# Altium project DashBoard.PrjPCB
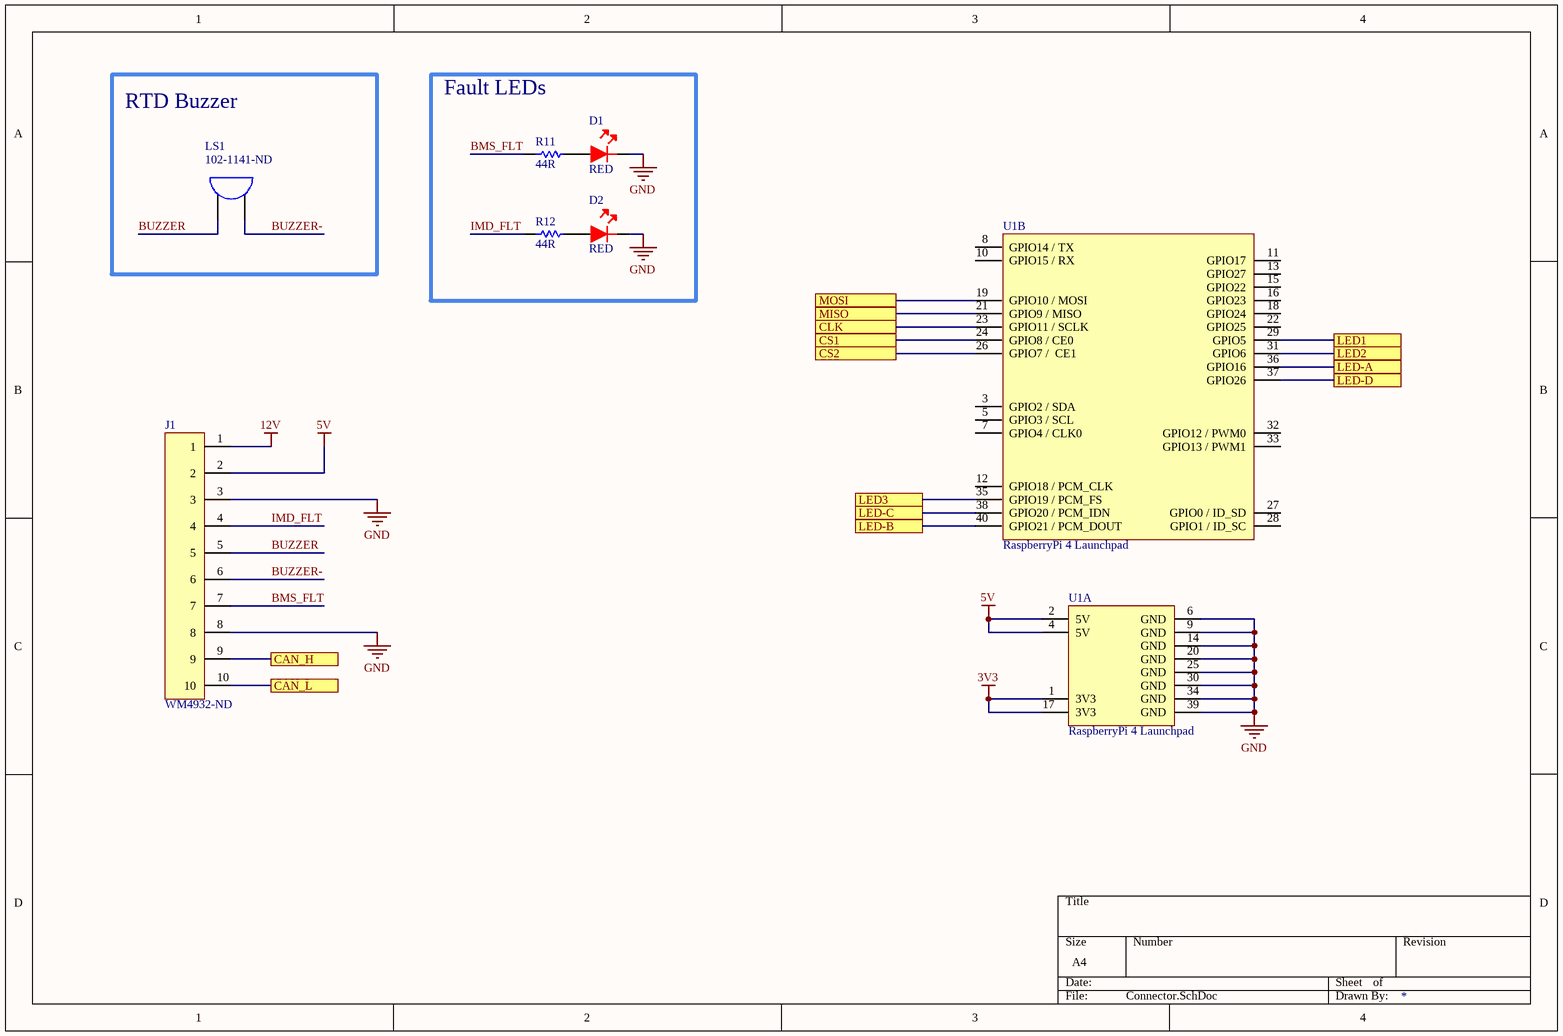
[diagram p0: Connector.SchDoc]
4 sheets, 50 parts. Net scope: flat (ports and power ports of the same name join across sheets).
Board file: DashBoard.PcbDoc
Sheets:
  Connector.SchDoc
  SpeedLEDs.SchDoc
  VoltageLEDs.SchDoc
  SPI.SchDoc

## Sheet Connector.SchDoc
size A4; Organization: Altium Limited; Address1: L3, 12a Rodborough Rd; Address2: Frenchs Forest; Address3: NSW; Address4: Australia 2086

### Parts
D1  RED  [LED]
D2  RED  [LED]
J1  WM4932-ND  [10PIN]
LS1  102-1141-ND  [Buzzer]
R11  44R  [RES-0603]
R12  44R  [RES-0603]
U1  RaspberryPi 4 Launchpad  [Rpi Connector]  (parts A,B of 2)

### Blocks framed on the sheet
RTD Buzzer: LS1
Fault LEDs: D1 D2 R11 R12

### Ports
CAN_H, CAN_L, CLK, CS1, CS2, LED1, LED2, LED3, LED-A, LED-B, LED-C, LED-D, MISO, MOSI

### Nets
3V3: U1.1(3V3) U1.17(3V3)
5V: J1.2 U1.2(5V) U1.4(5V)
12V: J1.1
GND: D1.2 D2.2 J1.3 J1.8 U1.6(GND) U1.9(GND) U1.14(GND) U1.20(GND) U1.25(GND) U1.30(GND) U1.34(GND) U1.39(GND)
A: U1.36(GPIO16) ; port LED-A
B: U1.40(GPIO21_/_PCM_DOUT) ; port LED-B
BMS_FLT: J1.7 R11.1
BUZZER: J1.5 LS1.1
BUZZER-: J1.6 LS1.2
C: U1.38(GPIO20_/_PCM_IDN) ; port LED-C
CAN_N: J1.10 ; port CAN_L
CAN_P: J1.9 ; port CAN_H
CS_1: U1.24(GPIO8_/_CE0) ; port CS1
CS_2: U1.26(GPIO7_/__CE1) ; port CS2
D: U1.37(GPIO26) ; port LED-D
IMD_FLT: J1.4 R12.1
LED-1: U1.29(GPIO5) ; port LED1
LED-2: U1.31(GPIO6) ; port LED2
LED-3: U1.35(GPIO19_/_PCM_FS) ; port LED3
SCK: U1.23(GPIO11_/_SCLK) ; port CLK
SDI: U1.19(GPIO10_/_MOSI) ; port MOSI
SDO: U1.21(GPIO9_/_MISO) ; port MISO
NetD1_1: D1.1 R11.2
NetD2_1: D2.1 R12.2

Not connected (* = marked no-connect by the designer): U1 3(GPIO2_/_SDA) 5(GPIO3_/_SCL) 7(GPIO4_/_CLK0) 8(GPIO14_/_TX) 10(GPIO15_/_RX) 11(GPIO17) 12(GPIO18_/_PCM_CLK) 13(GPIO27) 15(GPIO22) 16(GPIO23) 18(GPIO24) 22(GPIO25) 27(GPIO0_/_ID_SD) 28(GPIO1_/_ID_SC) 32(GPIO12_/_PWM0) 33(GPIO13_/_PWM1)

### Notes on the sheet
- Title
- Size:
- Date:
- A4
- Number:
- Time:
- Revision:
- Sheet
- of
- File:

### Library data of the parts
D1 D2 = RED_LED: 2835 PLCC2 RED WLD: 620NM TYP. 1; Manufacturer: QT-Brightek; Manufacturer Part Number: QBHP686-RH; Lens Color: Colorless; Lens Style: Flat; Lens Transparency: Clear; Forward Voltage: 2.4V; Test Current: 150mA; Viewing Angle: 120°; Supplier 1: Digi-Key; Stock 1: 3207; Pricing 1: 1=0.85, 10=0.553, 100=0.3625, 1000=0.2862 (USD); Mount: Surface Mount; Case/Package: 1113; Color: Red; Case Code (Imperial): 1113; Packaging: Tape and Reel; Dominant Wavelength: 620nm; Length: 3.1mm; Width: 2.8mm; Height: 1mm; ComponentLink1URL: http://www.qt-brightek.com/datasheet/QBHP686-XXH Series.pdf?src-supplier=Digi-Key; ComponentLink1Description: http://www.qt-brightek.com/datasheet/QBHP686-XXH Series.pdf?src-supplier=Digi-Key; Supplier Part Number 1: 1516-1369-6-ND
J1 = 10PIN: CONN HEADER R/A 10POS 2.54MM; Manufacturer: Molex; Manufacturer Part Number: 0705530044; Number of Positions: 10; Gender: Male; Contact Resistance: 30mR; Connector Type: Male Pin; Supplier 1: Digi-Key; Stock 1: 1173; Pricing 1: 1=2.61, 10=2.367, 100=2.0288, 500=1.69068, 1000=1.44915, 5000=1.28491 (USD); Mount: Through Hole; Housing Material: Polyester; Housing Color: Black; Contact Plating: Tin; Contact Material: Bronze; Color: Black; Min Operating Temperature: -40°C; Max Operating Temperature: 105°C; Number of Rows: 1; Packaging: Rail/Tube; Termination: Solder; Orientation: Right Angle; Number of Contacts: 10; Length: 27.95mm; Pitch: 2.54mm; Depth: 13.59mm; Contact Mating Length: 0.24inch; ComponentLink1URL: http://www.molex.com/webdocs/datasheets/pdf/en-us/0705530044_PCB_HEADERS.pdf?src-supplier=Avnet; ComponentLink1Description: http://www.molex.com/webdocs/datasheets/pdf/en-us/0705530044_PCB_HEADERS.pdf?src-supplier=Avnet; Supplier Part Number 1: WM4932-ND
LS1 = Buzzer: AUDIO PIEZO TRANSDUCER 30V TH; Manufacturer: CUI; Voltage Rating: 10V; Operating Supply Current: 8mA; Self Resonant Frequency: 2kHz; Capacitance: 28nF; Washable: No; Supplier 1: Digi-Key; Manufacturer Part Number: CEP-1116; Stock 1: 11267; Pricing 1: 1=1.91, 10=1.588, 25=1.468, 50=1.3806, 100=1.2963, 500=1.11268, 1000=1.0621 (USD); Mount: Through Hole; Case/Package: Radial; Min Operating Temperature: -30°C; Max Operating Temperature: 85°C; Packaging: Bulk; Termination: PC Pins; Diameter: 30mm; Height: 10.5mm; Lead Free: Lead Free; Supplier Part Number 1: 102-1141-ND
R11 R12 = 0603-44R: Manufacturer: Panasonic; Manufacturer Part Number: ERJ-3EKF44R2V; Resistance: 44.2R; Tolerance: 1%; Power Rating: 100mW; Voltage Rating: 75V; Temperature Coefficient: 100ppm/°C; Voltage Rating (DC): 50V; Supplier 1: Digi-Key; Stock 1: 31052; Pricing 1: 1=0.1, 10=0.037, 100=0.0149, 1000=0.0067, 2500=0.00582 (USD); Mount: Surface Mount; Case/Package: 0603; Case Code (Imperial): 0603; Case Code (Metric): 1608; Weight: 7.1E-05oz; Contact Plating: Tin; Min Operating Temperature: -55°C; Max Operating Temperature: 155°C; Packaging: Tape and Reel; Package Quantity: 1; Resistor Type: Thick Film; Termination: SMD/SMT; Number of Terminations: 2; Max Power Dissipation: 100mW; Features: Automotive AEC-Q200; Series: ERJ; Resistance Tolerance: 1%; Construction: Rectangular; Length: 1.6mm; Width: 0.8mm; Height: 0.022inch; Depth: 0.8mm; REACH SVHC: No SVHC; Military Standard: Not; RoHS Compliant: Yes; ComponentLink1URL: http://industrial.panasonic.com/www-data/pdf/AOA0000/AOA0000CE2.pdf?src-supplier=Avnet; ComponentLink1Description: http://industrial.panasonic.com/www-data/pdf/AOA0000/AOA0000CE2.pdf?src-supplier=Avnet; ComponentLink2URL: http://industrial.panasonic.com/cdbs/www-data/pdf/RDA0000/AOA0000C304.pdf?src-supplier=Farnell; ComponentLink2Description: http://industrial.panasonic.com/cdbs/www-data/pdf/RDA0000/AOA0000C304.pdf?src-supplier=Farnell; ComponentLink3URL: http://www.farnell.com/datasheets/426256.pdf?src-supplier=Element14; ComponentLink3Description: http://www.farnell.com/datasheets/426256.pdf?src-supplier=Element14; Supplier Part Number 1: P44.2HDKR-ND
U1 = RasPi4: CONNECTOR DEV BOARD RaspberryPi 4; Manufacturer: Sullins; Manufacturer Part Number: PPPC202LFBN-RC; Number of Positions: 40; Connector Type: Header; Pitch: 0.1inch; Supplier 1: Digi-Key; Stock 1: 10499; Pricing 1: 1=2.38, 10=2.068, 80=1.84838, 440=1.54034, 1000=1.3203, 5000=1.1736 (USD); Mount: Through Hole; Color: Black; Contact Plating: Gold; Contact Material: Bronze; Housing Material: Plastic; Package Quantity: 1000; Number of Rows: 2; Packaging: Bulk; Termination: Solder; Contact Type: Female Socket; Length: 51.3mm; Width: 5mm; Height: 8.5mm; Row Spacing: 0.1inch; Lead Free: Lead Free; RoHS Compliant: Yes; Supplier Part Number 1: S7123-ND

## Sheet SpeedLEDs.SchDoc
size A4; Organization: Altium Limited; Address1: L3, 12a Rodborough Rd; Address2: Frenchs Forest; Address3: NSW; Address4: Australia 2086
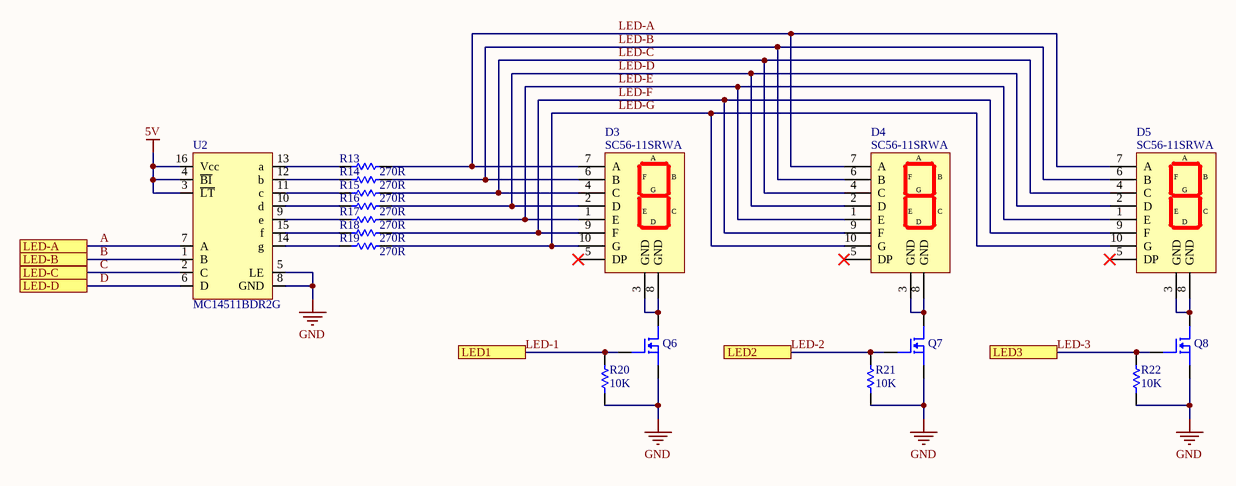
[diagram p1: SpeedLEDs.SchDoc]

### Parts
D3  SC56-11SRWA  [7-seg]
D4  SC56-11SRWA  [7-seg]
D5  SC56-11SRWA  [7-seg]
Q6  DMN6140L-13DICT-ND  [SOT-23-3]  (value not drawn)
Q7  DMN6140L-13DICT-ND  [SOT-23-3]  (value not drawn)
Q8  DMN6140L-13DICT-ND  [SOT-23-3]  (value not drawn)
R13  270R  [RES-0603]
R14  270R  [RES-0603]
R15  270R  [RES-0603]
R16  270R  [RES-0603]
R17  270R  [RES-0603]
R18  270R  [RES-0603]
R19  270R  [RES-0603]
R20  10K  [RES-0603]
R21  10K  [RES-0603]
R22  10K  [RES-0603]
U2  MC14511BDR2G  [SOIC16]

### Ports
LED1, LED2, LED3, LED-A, LED-B, LED-C, LED-D

### Nets
5V: U2.3(~{LT}) U2.4(~{BI}) U2.16(Vcc)
GND: Q6.3 Q7.3 Q8.3 R20.1 R21.1 R22.1 U2.5(LE) U2.8(GND)
A: U2.7(A) ; port LED-A
B: U2.1(B) ; port LED-B
C: U2.2(C) ; port LED-C
D: U2.6(D) ; port LED-D
LED-1: Q6.1 R20.2 ; port LED1
LED-2: Q7.1 R21.2 ; port LED2
LED-3: Q8.1 R22.2 ; port LED3
LED-A: D3.7(A) D4.7(A) D5.7(A) R13.2
LED-B: D3.6(B) D4.6(B) D5.6(B) R14.2
LED-C: D3.4(C) D4.4(C) D5.4(C) R15.2
LED-D: D3.2(D) D4.2(D) D5.2(D) R16.2
LED-E: D3.1(E) D4.1(E) D5.1(E) R17.2
LED-F: D3.9(F) D4.9(F) D5.9(F) R18.2
LED-G: D3.10(G) D4.10(G) D5.10(G) R19.2
NetD3_3: D3.3(GND) D3.8(GND) Q6.2
NetD4_3: D4.3(GND) D4.8(GND) Q7.2
NetD5_3: D5.3(GND) D5.8(GND) Q8.2
NetR13_1: R13.1 U2.13(a)
NetR14_1: R14.1 U2.12(b)
NetR15_1: R15.1 U2.11(c)
NetR16_1: R16.1 U2.10(d)
NetR17_1: R17.1 U2.9(e)
NetR18_1: R18.1 U2.15(f)
NetR19_1: R19.1 U2.14(g)

Not connected (* = marked no-connect by the designer): D3 5(DP)*; D4 5(DP)*; D5 5(DP)*

### Notes on the sheet
- Title
- Size:
- Date:
- A4
- Number:
- Time:
- Revision:
- Sheet
- of
- File:

### Library data of the parts
D3-D5 = 7-segment: DISPLAY 7SEG 0.56" SGL RED 10DIP; Manufacturer: Kingbright; Wavelength: 640nm; Luminous Intensity: 34mcd; Forward Voltage: 1.85V; Element Configuration: Common Cathode; Forward Current: 20mA; Number of Characters: 1; Max Power Dissipation: 75mW; Supplier 1: Digi-Key; Manufacturer Part Number: SC56-11SRWA; Stock 1: 32391; Pricing 1: 1=1.96, 10=1.24, 100=0.9177, 500=0.84334, 1000=0.702 (USD); Case/Package: DIP; Color: Red; Min Operating Temperature: -40°C; Max Operating Temperature: 85°C; Package Quantity: 40; Illumination Color: Red; Operating Supply Voltage: 1.85V; Packaging: Bulk; Test Current: 20mA; Display Type: Segment; Power Consumption: 75mW; Width: 0.5inch; Height: 0.75inch; RoHS Compliant: Yes; Lead Free: Lead Free; REACH SVHC: No SVHC; ComponentLink1URL: http://www.farnell.com/datasheets/2047590.pdf?src-supplier=Element14; ComponentLink1Description: http://www.farnell.com/datasheets/2047590.pdf?src-supplier=Element14; ComponentLink2URL: http://www.mouser.com/ds/2/216/SC56-11SRWA-66719.pdf?src-supplier=Mouser; ComponentLink2Description: http://www.mouser.com/ds/2/216/SC56-11SRWA-66719.pdf?src-supplier=Mouser; ComponentLink3URL: http://www.kingbrightusa.com/images/catalog/SPEC/SC56-11SRWA.pdf?src-supplier=Future+Electronics; ComponentLink3Description: http://www.kingbrightusa.com/images/catalog/SPEC/SC56-11SRWA.pdf?src-supplier=Future+Electronics; Supplier Part Number 1: 754-1467-5-ND
Q6-Q8 = N-FET-60V-1.6A: MOSFET N-CH 60V 1.6A SOT23; Manufacturer: Diodes; Rds On Max: 140mR; Input Capacitance: 315pF; Max Power Dissipation: 700mW; Supplier 1: Digi-Key; Manufacturer Part Number: DMN6140L-13; Stock 1: 274948; Pricing 1: 1=0.34, 10=0.256, 25=0.224, 100=0.1217, 250=0.12104, 500=0.09926, 1000=0.07365, 2500=0.06468, 5000=0.05924 (USD); Mount: Surface Mount; Case/Package: TO-236-3; Min Operating Temperature: -55°C; Max Operating Temperature: 150°C; Package Quantity: 10000; Packaging: Cut Tape; Drain to Source Voltage (Vdss): 60V; Continuous Drain Current (ID): 1.6A; ComponentLink1URL: https://www.diodes.com/assets/Datasheets/DMN6140L.pdf?src-supplier=Digi-Key; ComponentLink1Description: https://www.diodes.com/assets/Datasheets/DMN6140L.pdf?src-supplier=Digi-Key; Supplier Part Number 1: DMN6140L-13DIDKR-ND
R13-R19 = 0603-270R: RES SMD 270 OHM 0.5% 1/10W 0603; Manufacturer: Yageo; Manufacturer Part Number: RT0603DRE07270RL; Voltage Rating: 75V; Power Rating: 100mW; Temperature Coefficient: 50ppm/°C; Voltage Rating (DC): 50V; Supplier 1: Digi-Key; Stock 1: 5811; Pricing 1: 1=0.1, 10=0.092, 100=0.0352, 1000=0.01549, 2500=0.01338 (USD); Case/Package: 0603; Case Code (Metric): 1608; Case Code (Imperial): 0603; Min Operating Temperature: -55°C; Max Operating Temperature: 155°C; Resistance: 270R; Tolerance: 0.5%; Packaging: Tape and Reel; Package Quantity: 5000; Termination: SMD/SMT; Resistor Type: Thin Film; Number of Terminations: 2; Max Power Dissipation: 100mW; Features: Moisture Resistant; Series: RT; Length: 0.063inch; Width: 0.031inch; Height: 0.022inch; Lead Free: Lead Free; RoHS Compliant: Yes; ComponentLink1URL: http://www.yageo.com/NewPortal/yageodocoutput?fileName=/pdf/R-Chip/PYu-RT_1-to-0.05_RoHS_L_5.pdf&src-supplier=Digi-Key; ComponentLink1Description: http://www.yageo.com/NewPortal/yageodocoutput?fileName=/pdf/R-Chip/PYu-RT_1-to-0.05_RoHS_L_5.pdf&src-supplier=Digi-Key; Supplier Part Number 1: 311-2504-1-ND
R20-R22 = 0603-10KR: RES SMD 10K OHM 5% 1/10W 0603; Manufacturer: Yageo; Manufacturer Part Number: RC0603JR-0710KL; Resistance: 10kR; Voltage Rating (DC): 50V; Temperature Coefficient: 100ppm/°C; Power Rating: 100mW; Supplier 1: Digi-Key; Stock 1: 3006558; Pricing 1: 1=0.1, 10=0.019, 100=0.0077, 1000=0.00347, 2500=0.00301 (USD); Case/Package: 0603; Number of Pins: 2; Contact Plating: Tin,Matte; Case Code (Imperial): 0603; Case Code (Metric): 1608; Min Operating Temperature: -55°C; Max Operating Temperature: 155°C; Packaging: Tape and Reel; Tolerance: 5%; Composition: Thick Film; Voltage Rating: 50V; Termination: SMD/SMT; Military Standard: Not; Features: Moisture Resistant; Max Power Dissipation: 100mW; Number of Terminations: 2; Length: 0.063inch; Width: 0.031inch; Depth: 0.8mm; Height - Seated (Max): 0.022inch; Radiation Hardening: No; REACH SVHC: Unknown; Lead Free: Lead Free; ComponentLink1URL: http://www.yageo.com/documents/recent/PYu-RC_Group_51_RoHS_L_10.pdf?src-supplier=Digi-Key; ComponentLink1Description: http://www.yageo.com/documents/recent/PYu-RC_Group_51_RoHS_L_10.pdf?src-supplier=Digi-Key; Supplier Part Number 1: 311-10KGRDKR-ND
U2 = MC14511BDR2G: IC DRVR 7 SEGMENT 16SOIC; Manufacturer: ON Semiconductor; Number of Elements: 1; Propagation Delay: 1440ns; Max Supply Voltage: 18V; Min Supply Voltage: 3V; Number of Inputs: 4; Number of Outputs: 7; Operating Supply Current: 10uA; Logic Function: Decoder,Latch; Polarity: Non-Inverting; High Level Output Current: -25mA; Low Level Output Current: 4.2mA; Quiescent Current: 20uA; Display Type: LCD; Supplier 1: Digi-Key; Manufacturer Part Number: MC14511BDR2G; Stock 1: 82; Pricing 1: 1=0.63, 10=0.555, 25=0.5216, 100=0.4256, 250=0.39532, 500=0.33644, 1000=0.27772 (USD); Mount: Surface Mount; Case/Package: SOIC; Number of Pins: 16; Min Operating Temperature: -55°C; Max Operating Temperature: 125°C; Packaging: Tape and Reel; Package Quantity: 2500; Number of Bits: 4; Number of Input Lines: 4; Number of Output Lines: 7; Turn-On Delay Time: 1440ns; Series: -; Technology: CMOS; Radiation Hardening: No; Lead Free: Lead Free; Halogen Free: Halogen Free; RoHS Compliant: Yes; ComponentLink1URL: https://www.verical.com/server-webapp/html/getDatasheet?partID=319336&src-supplier=Verical; ComponentLink1Description: https://www.verical.com/server-webapp/html/getDatasheet?partID=319336&src-supplier=Verical; ComponentLink2URL: http://www.onsemi.com/pub_link/Collateral/MC14511B-D.PDF?src-supplier=Digi-Key; ComponentLink2Description: http://www.onsemi.com/pub_link/Collateral/MC14511B-D.PDF?src-supplier=Digi-Key; Supplier Part Number 1: MC14511BDR2GOSDKR-ND

## Sheet VoltageLEDs.SchDoc
size A4; Organization: Altium Limited; Address1: L3, 12a Rodborough Rd; Address2: Frenchs Forest; Address3: NSW; Address4: Australia 2086
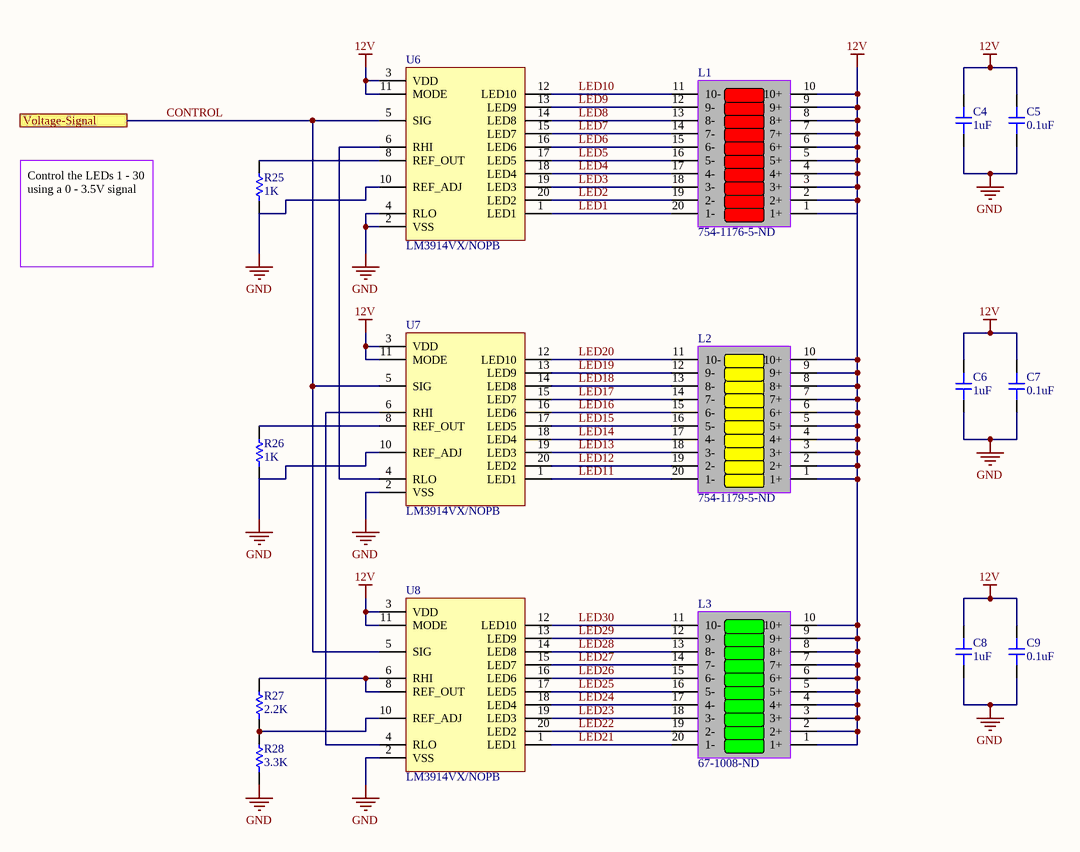
[diagram p2: VoltageLEDs.SchDoc]

### Parts
C4  1uF  [CAP-0805]
C5  0.1uF  [CAP-0805]
C6  1uF  [CAP-0805]
C7  0.1uF  [CAP-0805]
C8  1uF  [CAP-0805]
C9  0.1uF  [CAP-0805]
L1  754-1176-5-ND  [LEDBAR-10]
L2  754-1179-5-ND  [LEDBAR-10]
L3  67-1008-ND  [LEDBAR-10]
R25  1K  [RES-0603]
R26  1K  [RES-0603]
R27  2.2K  [RES-0603]
R28  3.3K  [RES-0603]
U6  LM3914VX/NOPB  [PLCC127P990X990X457-20N]
U7  LM3914VX/NOPB  [PLCC127P990X990X457-20N]
U8  LM3914VX/NOPB  [PLCC127P990X990X457-20N]

### Ports
Voltage-Signal

### Nets
12V: C4.2 C5.2 C6.2 C7.2 C8.2 C9.2 L1.1(1+) L1.2(2+) L1.3(3+) L1.4(4+) L1.5(5+) L1.6(6+) L1.7(7+) L1.8(8+) L1.9(9+) L1.10(10+) L2.1(1+) L2.2(2+) L2.3(3+) L2.4(4+) L2.5(5+) L2.6(6+) L2.7(7+) L2.8(8+) L2.9(9+) L2.10(10+) L3.1(1+) L3.2(2+) L3.3(3+) L3.4(4+) L3.5(5+) L3.6(6+) L3.7(7+) L3.8(8+) L3.9(9+) L3.10(10+) U6.3(VDD) U6.11(MODE) U7.3(VDD) U7.11(MODE) U8.3(VDD) U8.11(MODE)
GND: C4.1 C5.1 C6.1 C7.1 C8.1 C9.1 R25.1 R26.1 R28.1 U6.2(VSS) U6.4(RLO) U6.10(REF_ADJ) U7.2(VSS) U7.10(REF_ADJ) U8.2(VSS)
CONTROL: U6.5(SIG) U7.5(SIG) U8.5(SIG) ; port Voltage-Signal
LED1: L1.20(1-) U6.1(LED1)
LED2: L1.19(2-) U6.20(LED2)
LED3: L1.18(3-) U6.19(LED3)
LED4: L1.17(4-) U6.18(LED4)
LED5: L1.16(5-) U6.17(LED5)
LED6: L1.15(6-) U6.16(LED6)
LED7: L1.14(7-) U6.15(LED7)
LED8: L1.13(8-) U6.14(LED8)
LED9: L1.12(9-) U6.13(LED9)
LED10: L1.11(10-) U6.12(LED10)
LED11: L2.20(1-) U7.1(LED1)
LED12: L2.19(2-) U7.20(LED2)
LED13: L2.18(3-) U7.19(LED3)
LED14: L2.17(4-) U7.18(LED4)
LED15: L2.16(5-) U7.17(LED5)
LED16: L2.15(6-) U7.16(LED6)
LED17: L2.14(7-) U7.15(LED7)
LED18: L2.13(8-) U7.14(LED8)
LED19: L2.12(9-) U7.13(LED9)
LED20: L2.11(10-) U7.12(LED10)
LED21: L3.20(1-) U8.1(LED1)
LED22: L3.19(2-) U8.20(LED2)
LED23: L3.18(3-) U8.19(LED3)
LED24: L3.17(4-) U8.18(LED4)
LED25: L3.16(5-) U8.17(LED5)
LED26: L3.15(6-) U8.16(LED6)
LED27: L3.14(7-) U8.15(LED7)
LED28: L3.13(8-) U8.14(LED8)
LED29: L3.12(9-) U8.13(LED9)
LED30: L3.11(10-) U8.12(LED10)
NetR25_2: R25.2 U6.8(REF_OUT)
NetR26_2: R26.2 U7.8(REF_OUT)
NetR27_1: R27.1 R28.2 U8.10(REF_ADJ)
NetR27_2: R27.2 U8.6(RHI) U8.8(REF_OUT)
NetU6_6: U6.6(RHI) U7.4(RLO)
NetU7_6: U7.6(RHI) U8.4(RLO)

### Notes on the sheet
- Control the LEDs 1 - 30 using a 0 - 3.5V signal
- Title
- Size:
- Date:
- A4
- Number:
- Time:
- Revision:
- Sheet
- of
- File:

### Library data of the parts
C4 C6 C8 = C0805C105K5PACTU: CAP CER 1UF 50V X5R 0805; Manufacturer: KEMET; Dielectric Material: Ceramic; Tolerance: 10%; Supplier 1: Digi-Key; Manufacturer Part Number: C0805C105K5PACTU; Stock 1: 7193; Pricing 1: 1=0.33, 10=0.23, 100=0.1378, 500=0.10334, 1000=0.08726 (USD); Mount: Surface Mount; Case/Package: 0805; Weight: 0.000194oz; Case Code (Metric): 2012; Case Code (Imperial): 0805; Min Operating Temperature: -55°C; Max Operating Temperature: 85°C; Voltage Rating: 50V; Dielectric: X5R; Packaging: Tape and Reel; Termination: SMD/SMT; Voltage Rating (DC): 50V; Package Quantity: 2500; Capacitance: 1uF; Length: 0.079inch; Width: 0.049inch; Thickness: 0.055inch; REACH SVHC: No SVHC; Lead Free: Lead Free; ComponentLink1URL: https://api.kemet.com/component-edge/download/datasheet/C0805C105K5PAC7800.pdf?src-supplier=Digi-Key; ComponentLink1Description: https://api.kemet.com/component-edge/download/datasheet/C0805C105K5PAC7800.pdf?src-supplier=Digi-Key; ComponentLink2URL: http://www.farnell.com/datasheets/2746140.pdf?src-supplier=Farnell; ComponentLink2Description: http://www.farnell.com/datasheets/2746140.pdf?src-supplier=Farnell; ComponentLink3URL: http://www.mouser.com/ds/2/212/KEM_C1006_X5R_SMD-1103249.pdf?src-supplier=Mouser; ComponentLink3Description: http://www.mouser.com/ds/2/212/KEM_C1006_X5R_SMD-1103249.pdf?src-supplier=Mouser; ComponentLink4URL: http://www.farnell.com/datasheets/2746140.pdf?src-supplier=Newark; ComponentLink4Description: http://www.farnell.com/datasheets/2746140.pdf?src-supplier=Newark; ComponentLink5URL: http://www.farnell.com/datasheets/2032728.pdf?src-supplier=Element14; ComponentLink5Description: http://www.farnell.com/datasheets/2032728.pdf?src-supplier=Element14; Supplier Part Number 1: 399-15436-6-ND
C5 C7 C9 = C0805C104Z5VACTU: CAP CER 0.1UF 50V Y5V 0805; Manufacturer: KEMET; Dielectric Material: Ceramic; Capacitance: 100nF; Tolerance: 80%; Dissipation Factor: 5%; Supplier 1: Digi-Key; Manufacturer Part Number: C0805C104Z5VACTU; Stock 1: 929243; Pricing 1: 1=0.1, 10=0.057, 100=0.0254, 500=0.01818, 1000=0.01428 (USD); Mount: Surface Mount,PCB; Case/Package: 0805; Number of Pins: 2; Case Code (Metric): 2012; Case Code (Imperial): 0805; Min Operating Temperature: -30°C; Max Operating Temperature: 85°C; Package Quantity: 1; Voltage Rating: 50V; Packaging: Tape and Reel; Voltage Rating (DC): 50V; Dielectric: Y5V; Termination: SMD/SMT; Voltage: 50V; Length: 2mm; Height: 0.9mm; Lead Pitch: 0.75mm; Width: 0.049inch; Thickness: 0.039inch; Depth: 1.25mm; Radiation Hardening: No; REACH SVHC: No SVHC; Lead Free: Lead Free; ComponentLink1URL: http://www.alliedelec.com/m/d/9bfe7773041ffe9d406e68bc7b377fdd.pdf?src-supplier=Allied+Electronics; ComponentLink1Description: http://www.alliedelec.com/m/d/9bfe7773041ffe9d406e68bc7b377fdd.pdf?src-supplier=Allied+Electronics; ComponentLink2URL: https://www.verical.com/server-webapp/html/getDatasheet?partID=37101&src-supplier=Verical; ComponentLink2Description: https://www.verical.com/server-webapp/html/getDatasheet?partID=37101&src-supplier=Verical; ComponentLink3URL: https://www.verical.com/server-webapp/html/getDatasheet?partID=321176&src-supplier=Verical; ComponentLink3Description: https://www.verical.com/server-webapp/html/getDatasheet?partID=321176&src-supplier=Verical; ComponentLink4URL: http://www.farnell.com/datasheets/2123124.pdf?src-supplier=Element14; ComponentLink4Description: http://www.farnell.com/datasheets/2123124.pdf?src-supplier=Element14; Supplier Part Number 1: 399-1177-6-ND
L1 = 754-1176-5-ND: LED BAR GRAPH 10SEG 627NM RED; Manufacturer: Kingbright; Manufacturer Part Number: DC-10EWA; Lens Color: White; Lens Style: Diffused; Voltage Rating: 2V; Luminous Intensity: 9mcd; Wavelength: 625nm; Current: 30mA; Number of Segments: 10; Forward Current: 20mA; Lens Size: 1.78mm; Supplier 1: Digi-Key; Stock 1: 21; Pricing 1: 1=2.79, 10=2.474, 100=1.4364, 500=1.2768, 1000=1.09725, 2500=1.0374, 5000=1.01346, 10000=0.9975, 25000=0.97356 (USD); Mount: Through Hole; Color: Red; Min Operating Temperature: -40°C; Max Operating Temperature: 85°C; Forward Voltage: 2V; Illumination Color: Red; Package Quantity: 20; Operating Supply Voltage: 2V; Packaging: Rail/Tube; Number of LEDs: 10; Display Type: Bar Graph; Length: 25.4mm; Height: 10.16mm; Width: 25.4mm; REACH SVHC: No SVHC; Lead Free: Lead Free; ComponentLink1URL: https://www.distrelec.biz/Web/Downloads/12/75/tl661272-661275.pdf?mime=application%2Fpdf&src-supplier=Distrelec; ComponentLink1Description: https://www.distrelec.biz/Web/Downloads/12/75/tl661272-661275.pdf?mime=application%2Fpdf&src-supplier=Distrelec; ComponentLink2URL: http://www.mouser.com/ds/2/216/DC10EWA-8483.pdf?src-supplier=Mouser; ComponentLink2Description: http://www.mouser.com/ds/2/216/DC10EWA-8483.pdf?src-supplier=Mouser; ComponentLink3URL: http://www.kingbrightusa.com/images/catalog/SPEC/DC10EWA.pdf?src-supplier=Digi-Key; ComponentLink3Description: http://www.kingbrightusa.com/images/catalog/SPEC/DC10EWA.pdf?src-supplier=Digi-Key; ComponentLink4URL: http://uk.rs-online.com/webdocs/1385/0900766b81385017.pdf?src-supplier=RSComponents; ComponentLink4Description: http://uk.rs-online.com/webdocs/1385/0900766b81385017.pdf?src-supplier=RSComponents; ComponentLink5URL: http://www.rapidonline.com/pdf/55-0190e.pdf?src-supplier=Rapid+Electronics; ComponentLink5Description: http://www.rapidonline.com/pdf/55-0190e.pdf?src-supplier=Rapid+Electronics; ComponentLink6URL: http://www.farnell.com/datasheets/1683489.pdf?src-supplier=Element14; ComponentLink6Description: http://www.farnell.com/datasheets/1683489.pdf?src-supplier=Element14; ComponentLink7URL: http://www.produktinfo.conrad.com/datenblaetter/175000-199999/184837-da-01-en-RGB_ROT_LED_BAND.pdf?src-supplier=Conrad; ComponentLink7Description: http://www.produktinfo.conrad.com/datenblaetter/175000-199999/184837-da-01-en-RGB_ROT_LED_BAND.pdf?src-supplier=Conrad; ComponentLink8URL: http://www.produktinfo.conrad.com/datenblaetter/150000-174999/160137-da-01-en-BARGRAPH_ANZEIGE_TYP_DC_10EWA.pdf?src-supplier=Conrad; ComponentLink8Description: http://www.produktinfo.conrad.com/datenblaetter/150000-174999/160137-da-01-en-BARGRAPH_ANZEIGE_TYP_DC_10EWA.pdf?src-supplier=Conrad; Supplier Part Number 1: 754-1176-5-ND
L2 = LEDBAR-10-YLW: LED BAR GRAPH 10SEG 590NM YLW; Manufacturer: Kingbright; Manufacturer Part Number: DC-10YWA; Color: Yellow; Lens Color: White; Lens Style: Diffused,Round,Domed; Voltage Rating: 2.1V; Luminous Intensity: 9mcd; Wavelength: 588nm; Current: 30mA; Number of Segments: 10; Forward Current: 20mA; Lens Size: 3mm; Supplier 1: Digi-Key; Stock 1: 23; Pricing 1: 1=2.84, 10=2.517, 100=1.4616, 500=1.2992, 1000=1.1165, 2500=1.0556, 5000=1.03124, 10000=1.015, 25000=0.99064 (USD); Mount: Through Hole; Number of Pins: 20; Min Operating Temperature: -40°C; Max Operating Temperature: 85°C; Package Quantity: 20; Packaging: Rail/Tube; Forward Voltage: 2.1V; Illumination Color: Yellow; Operating Supply Voltage: 2.1V; Number of LEDs: 10; Display Type: Bar Graph; Height: 10.16mm; Width: 25.4mm; REACH SVHC: No SVHC; ComponentLink1URL: http://www.rapidonline.com/pdf/55-0190e.pdf?src-supplier=Rapid+Electronics; ComponentLink1Description: http://www.rapidonline.com/pdf/55-0190e.pdf?src-supplier=Rapid+Electronics; ComponentLink2URL: https://www.distrelec.biz/Web/Downloads/12/75/tl661272-661275.pdf?mime=application%2Fpdf&src-supplier=Distrelec; ComponentLink2Description: https://www.distrelec.biz/Web/Downloads/12/75/tl661272-661275.pdf?mime=application%2Fpdf&src-supplier=Distrelec; ComponentLink3URL: http://www.kingbrightusa.com/images/catalog/SPEC/DC10YWA.pdf?src-supplier=Digi-Key; ComponentLink3Description: http://www.kingbrightusa.com/images/catalog/SPEC/DC10YWA.pdf?src-supplier=Digi-Key; ComponentLink4URL: http://uk.rs-online.com/webdocs/0026/0900766b80026db8.pdf?src-supplier=RSComponents; ComponentLink4Description: http://uk.rs-online.com/webdocs/0026/0900766b80026db8.pdf?src-supplier=RSComponents; ComponentLink5URL: http://www.farnell.com/datasheets/1683491.pdf?src-supplier=Element14; ComponentLink5Description: http://www.farnell.com/datasheets/1683491.pdf?src-supplier=Element14; ComponentLink6URL: http://www.mouser.com/ds/2/216/DC10YWA-43302.pdf?src-supplier=Mouser; ComponentLink6Description: http://www.mouser.com/ds/2/216/DC10YWA-43302.pdf?src-supplier=Mouser; ComponentLink7URL: http://www.produktinfo.conrad.com/datenblaetter/150000-174999/160142-da-01-en-BARGRAPH_ANZEIGE_TYP_DC_10YWA.pdf?src-supplier=Conrad; ComponentLink7Description: http://www.produktinfo.conrad.com/datenblaetter/150000-174999/160142-da-01-en-BARGRAPH_ANZEIGE_TYP_DC_10YWA.pdf?src-supplier=Conrad; Supplier Part Number 1: 754-1179-5-ND
L3 = LEDBAR-10-GRN: LED ARRAY 10X25MM 10SEG GRN DIFF; Manufacturer: Lumex; Manufacturer Part Number: SSA-LXB10GW-GF/LP; Color: Green; Voltage Rating: 2.2V; Operating Supply Voltage: 2.6V; Number of Contacts: 18; Display Type: Bar Graph; Luminous Intensity: 8mcd; Forward Current: 20mA; Wavelength: 565nm; Power Consumption: 105mW; Viewing Angle: 160°; Lens Style: Diffused; Current: 25mA; Number of LEDs: 10; Supplier 1: Digi-Key; Stock 1: 6048; Pricing 1: 1=2.28, 10=2.018, 100=1.1718, 500=1.0416, 1000=0.89513, 2500=0.8463, 5000=0.82677, 10000=0.81375 (USD); Mount: Through Hole; Min Operating Temperature: -40°C; Max Operating Temperature: 85°C; Package Quantity: 20; Packaging: Bulk; Forward Voltage: 2.2V; Illumination Color: Green; Length: 25.1mm; Height: 6.8mm; Width: 10.1mm; REACH SVHC: No SVHC; Lead Free: Lead Free; ComponentLink1URL: http://www.lumex.com/content/files/ProductAttachment/SSA-LXB10GW-GF-LP.pdf?src-supplier=Digi-Key; ComponentLink1Description: http://www.lumex.com/content/files/ProductAttachment/SSA-LXB10GW-GF-LP.pdf?src-supplier=Digi-Key; ComponentLink2URL: http://www.farnell.com/datasheets/677482.pdf?src-supplier=Farnell; ComponentLink2Description: http://www.farnell.com/datasheets/677482.pdf?src-supplier=Farnell; ComponentLink3URL: http://www.farnell.com/datasheets/677482.pdf?src-supplier=Element14; ComponentLink3Description: http://www.farnell.com/datasheets/677482.pdf?src-supplier=Element14; ComponentLink4URL: http://www.farnell.com/datasheets/269031.pdf?src-supplier=Element14; ComponentLink4Description: http://www.farnell.com/datasheets/269031.pdf?src-supplier=Element14; ComponentLink5URL: http://www.mouser.com/ds/2/244/SSA-LXB10GW-GF%20LP-115645.pdf?src-supplier=Mouser; ComponentLink5Description: http://www.mouser.com/ds/2/244/SSA-LXB10GW-GF%20LP-115645.pdf?src-supplier=Mouser; Supplier Part Number 1: 67-1008-ND
R25 R26 = 0603-1KR: RES SMD 1K OHM 1% 1/10W 0603; Manufacturer: Vishay Dale; Manufacturer Part Number: CRCW06031K00FKEA; Resistance: 1kR; Power Rating: 100mW; Voltage Rating: 75V; Temperature Coefficient: 100ppm/°C; Supplier 1: Digi-Key; Stock 1: 671453; Pricing 1: 1=0.1, 10=0.034, 100=0.0139, 1000=0.00623, 2500=0.0054 (USD); Mount: Surface Mount; Case/Package: 0603; Number of Pins: 2; Weight: 7.1E-05oz; Case Code (Metric): 1608; Case Code (Imperial): 0603; Contact Plating: Tin; Min Operating Temperature: -55°C; Max Operating Temperature: 155°C; Composition: Thick Film; Tolerance: 1%; Packaging: Tape and Reel; Package Quantity: 10; Number of Terminations: 2; Termination: SMD/SMT; Military Standard: Not; Max Power Dissipation: 100mW; Voltage Rating (DC): 75V; Features: Automotive AEC-Q200; Length: 1.55mm; Height: 0.45mm; Width: 0.033inch; Depth: 0.85mm; Radiation Hardening: No; REACH SVHC: Unknown; Lead Free: Lead Free; ComponentLink1URL: http://www.vishay.com/docs/20035/dcrcwe3.pdf?src-supplier=Digi-Key; ComponentLink1Description: http://www.vishay.com/docs/20035/dcrcwe3.pdf?src-supplier=Digi-Key; ComponentLink2URL: http://uk.rs-online.com/webdocs/0d98/0900766b80d98afc.pdf?src-supplier=RSComponents; ComponentLink2Description: http://uk.rs-online.com/webdocs/0d98/0900766b80d98afc.pdf?src-supplier=RSComponents; ComponentLink3URL: http://www.vishay.com/docs/20035/dcrcwe3.pdf?src-supplier=Avnet; ComponentLink3Description: http://www.vishay.com/docs/20035/dcrcwe3.pdf?src-supplier=Avnet; ComponentLink4URL: http://www.vishay.com/docs/20035/dcrcwe3.pdf?src-supplier=Avnet+Asia; ComponentLink4Description: http://www.vishay.com/docs/20035/dcrcwe3.pdf?src-supplier=Avnet+Asia; ComponentLink5URL: http://www.farnell.com/datasheets/2310790.pdf?src-supplier=Element14; ComponentLink5Description: http://www.farnell.com/datasheets/2310790.pdf?src-supplier=Element14; ComponentLink6URL: https://www.distrelec.biz/Web/Downloads/a_/en/flD-CRCW-e3_data_en.pdf?mime=application%2Fpdf&src-supplier=Distrelec; ComponentLink6Description: https://www.distrelec.biz/Web/Downloads/a_/en/flD-CRCW-e3_data_en.pdf?mime=application%2Fpdf&src-supplier=Distrelec; ComponentLink7URL: http://www.vishay.com/docs/20035/dcrcwe3.pdf?src-supplier=Future+Electronics; ComponentLink7Description: http://www.vishay.com/docs/20035/dcrcwe3.pdf?src-supplier=Future+Electronics; ComponentLink8URL: http://www.vishay.com/docs/20035/dcrcwe3.pdf?src-supplier=Avnet+Europe; ComponentLink8Description: http://www.vishay.com/docs/20035/dcrcwe3.pdf?src-supplier=Avnet+Europe; Supplier Part Number 1: 541-1.00KHCT-ND
R27 = RC0603FR-072K2L: RES SMD 2.2K OHM 1% 1/10W 0603; Manufacturer: Yageo Phycomp; Power Rating: 100mW; Temperature Coefficient: 100ppm/°C; Resistance: 2.2kR; Voltage Rating (DC): 50V; Supplier 1: Digi-Key; Manufacturer Part Number: RC0603FR-072K2L; Stock 1: 8205077; Pricing 1: 1=0.1, 10=0.023, 100=0.0094, 1000=0.00421, 2500=0.00366 (USD); Mount: Surface Mount; Case/Package: 0603; Number of Pins: 2; Min Operating Temperature: -55°C; Max Operating Temperature: 155°C; Tolerance: 1%; Packaging: Cut Tape; Length: 1.6mm; Height: 0.45mm; Depth: 0.8mm; Width: 800um; REACH SVHC: No SVHC; Lead Free: Lead Free; Supplier Part Number 1: 311-2.20KHRDKR-ND
R28 = RC0603FR-073K3L: RES SMD 3.3K OHM 1% 1/10W 0603; Manufacturer: Yageo Phycomp; Power Rating: 100mW; Temperature Coefficient: 100ppm/°C; Voltage Rating (DC): 50V; Resistance: 3.3kR; Supplier 1: Digi-Key; Manufacturer Part Number: RC0603FR-073K3L; Stock 1: 3313966; Pricing 1: 1=0.1, 10=0.023, 100=0.0094, 1000=0.00421, 2500=0.00366 (USD); Mount: Surface Mount; Case/Package: 0603; Number of Pins: 2; Min Operating Temperature: -55°C; Max Operating Temperature: 155°C; Tolerance: 1%; Packaging: Cut Tape; Length: 1.6mm; Height: 0.45mm; Depth: 0.8mm; Width: 800um; REACH SVHC: No SVHC; Lead Free: Lead Free; Supplier Part Number 1: 311-3.30KHRDKR-ND
U6-U8 = LM3914VX/NOPB: IC DRVR DOT/BAR DISPLAY 20PLCC; Manufacturer: TI National Semiconductor; Max Supply Voltage: 25V; Max Power Dissipation: 1.365W; Output Current: 30mA; Number of Segments: 10; Nominal Supply Current: 9.2mA; Display Type: LCD; Supplier 1: Digi-Key; Manufacturer Part Number: LM3914VX/NOPB; Stock 1: 8115; Pricing 1: 1=4.32, 10=3.883, 25=3.6704, 100=3.1811, 250=3.01796, 500=2.70802 (USD); Mount: Surface Mount; Case/Package: PLCC; Number of Pins: 20; Min Operating Temperature: 0°C; Max Operating Temperature: 70°C; Packaging: Tape and Reel; Package Quantity: 1000; Series: LM3914; Max Supply Current: 9.2mA; Number of Outputs: 10; Power Dissipation: 1.365W; Number of Channels: 10; Supply Current: 9.2mA; Width: 8.89mm; Radiation Hardening: No; Lead Free: Lead Free; ComponentLink1URL: http://www.jameco.com/Jameco/Products/ProdDS/1282476.pdf?src-supplier=Jameco; ComponentLink1Description: http://www.jameco.com/Jameco/Products/ProdDS/1282476.pdf?src-supplier=Jameco; ComponentLink2URL: http://www.ti.com/general/docs/lit/getliterature.tsp?genericPartNumber=LM3914&&fileType=pdf&src-supplier=Avnet; ComponentLink2Description: http://www.ti.com/general/docs/lit/getliterature.tsp?genericPartNumber=LM3914&&fileType=pdf&src-supplier=Avnet; ComponentLink3URL: https://www.verical.com/server-webapp/html/getDatasheet?partID=632645&src-supplier=Verical; ComponentLink3Description: https://www.verical.com/server-webapp/html/getDatasheet?partID=632645&src-supplier=Verical; ComponentLink4URL: http://www.ti.com/lit/ds/symlink/lm3914.pdf?src-supplier=Digi-Key; ComponentLink4Description: http://www.ti.com/lit/ds/symlink/lm3914.pdf?src-supplier=Digi-Key; Supplier Part Number 1: LM3914VX/NOPBDKR-ND

## Sheet SPI.SchDoc
size A4; Organization: Altium Limited; Address1: L3, 12a Rodborough Rd; Address2: Frenchs Forest; Address3: NSW; Address4: Australia 2086
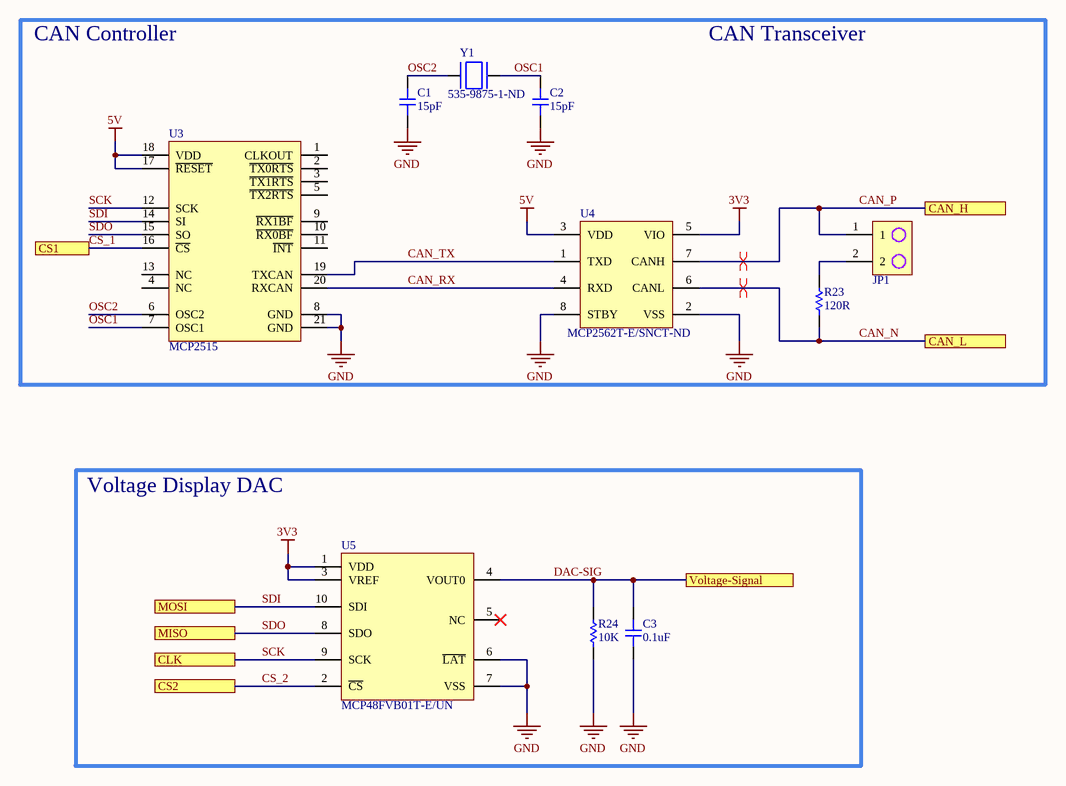
[diagram p3: SPI.SchDoc]

### Parts
C1  15pF  [CAP-0603]
C2  15pF  [CAP-0603]
C3  0.1uF  [CAP-0805]
JP1  732-5315-ND  [2PIN-JP]  (value not drawn)
R23  120R  [RES-0603]
R24  10K  [RES-0603]
U3  MCP2515  [QFN20-EP]
U4  MCP2562T-E/SNCT-ND  [8-SOIC w/o THRM]
U5  MCP48FVB01T-E/UN  [10MSOP]
Y1  535-9875-1-ND  [CRYSTAL-ABLS2]

### Blocks framed on the sheet
Voltage Display DAC: C3 R24 U5

### Ports
CAN_H, CAN_L, CLK, CS1, CS2, MISO, MOSI, Voltage-Signal

### Nets
3V3: U4.5(VIO) U5.1(VDD) U5.3(VREF)
5V: U3.17(~{RESET}) U3.18(VDD) U4.3(VDD)
GND: C1.1 C2.1 C3.1 R24.1 U3.8(GND) U3.21(GND) U4.2(VSS) U4.8(STBY) U5.6(~{LAT}) U5.7(VSS)
CAN_N: R23.1 U4.6(CANL) ; port CAN_L
CAN_P: JP1.1 U4.7(CANH) ; port CAN_H
CAN_RX: U3.20(RXCAN) U4.4(RXD)
CAN_TX: U3.19(TXCAN) U4.1(TXD)
CS_1: U3.16(~{CS}) ; port CS1
CS_2: U5.2(~{CS}) ; port CS2
DAC-SIG: C3.2 R24.2 U5.4(VOUT0) ; port Voltage-Signal  [project net CONTROL]
OSC1: C2.2 U3.7(OSC1) Y1.2
OSC2: C1.2 U3.6(OSC2) Y1.1
SCK: U3.12(SCK) U5.9(SCK) ; port CLK
SDI: U3.14(SI) U5.10(SDI) ; port MOSI
SDO: U3.15(SO) U5.8(SDO) ; port MISO
NetJP1_2: JP1.2 R23.2

Not connected (* = marked no-connect by the designer): U3 1(CLKOUT) 2(~{TX0RTS}) 3(~{TX1RTS}) 4(NC) 5(~{TX2RTS}) 9(~{RX1BF}) 10(~{RX0BF}) 11(~{INT}) 13(NC); U5 5(NC)*

### Layout directives
differential pair: CAN_N, CAN_P

### Notes on the sheet
- CAN Controller
- CAN Transceiver
- Title
- Size:
- Date:
- A4
- Number:
- Time:
- Revision:
- Sheet
- of
- File:

### Library data of the parts
C1 C2 = 0603-15pF-100V: CAP CER 15PF 100V C0G/NP0 0603; Manufacturer: Murata; Manufacturer Part Number: GRM1885C2A150JA01D; Material: Ceramic; Tolerance: 5%; Dielectric: C0G; Supplier 1: Digi-Key; Stock 1: 216098; Pricing 1: 1=0.12, 10=0.088, 100=0.0413, 500=0.02896, 1000=0.02397 (USD); Mount: Surface Mount; Case/Package: 0603; Case Code (Imperial): 0603; Case Code (Metric): 1608; Min Operating Temperature: -55°C; Max Operating Temperature: 125°C; Capacitance: 15pF; Packaging: Tape and Reel; Package Quantity: 1; Voltage Rating: 100V; Voltage Rating (DC): 100V; Termination: SMD/SMT; Voltage: 100V; Length: 1.6mm; Height: 0.8mm; Width: 0.8mm; Thickness: 0.035inch; Depth: 0.8mm; Radiation Hardening: No; Lead Free: Lead Free; ComponentLink1URL: http://components.arrow.com/part/dataview/40422412S9717204N2606?src-supplier=Arrow; ComponentLink1Description: http://components.arrow.com/part/dataview/40422412S9717204N2606?src-supplier=Arrow; ComponentLink2URL: http://psearch.murata.com/capacitor/product/GRM1885C2A150JA01%23.pdf?src-supplier=Avnet; ComponentLink2Description: http://psearch.murata.com/capacitor/product/GRM1885C2A150JA01%23.pdf?src-supplier=Avnet; ComponentLink3URL: http://www.mouser.com/ds/2/281/c02e-2905.pdf?src-supplier=Mouser; ComponentLink3Description: http://www.mouser.com/ds/2/281/c02e-2905.pdf?src-supplier=Mouser; ComponentLink4URL: https://www.murata.com/~/media/webrenewal/support/library/catalog/products/capacitor/mlcc/c02e.ashx?la=en-us&src-supplier=Digi-Key; ComponentLink4Description: https://www.murata.com/~/media/webrenewal/support/library/catalog/products/capacitor/mlcc/c02e.ashx?la=en-us&src-supplier=Digi-Key; ComponentLink5URL: http://search.murata.co.jp/Ceramy/image/img/A01X/partnumbering_e_01.pdf?src-supplier=Digi-Key; ComponentLink5Description: http://search.murata.co.jp/Ceramy/image/img/A01X/partnumbering_e_01.pdf?src-supplier=Digi-Key; ComponentLink6URL: https://produktinfo.conrad.com/datenblaetter/450000-474999/451247-da-01-en-VS_KONDENSATOR_0603.pdf?src-supplier=Conrad; ComponentLink6Description: https://produktinfo.conrad.com/datenblaetter/450000-474999/451247-da-01-en-VS_KONDENSATOR_0603.pdf?src-supplier=Conrad; Supplier Part Number 1: 490-1331-6-ND
C3 = C0805C104Z5VACTU: as C5 on sheet VoltageLEDs; Supplier 1: Digi-Key; Manufacturer Part Number: C0805C104Z5VACTU; Stock 1: 929243; Pricing 1: 1=0.1, 10=0.057, 100=0.0254, 500=0.01818, 1000=0.01428 (USD); Mount: Surface Mount,PCB; Case/Package: 0805; Number of Pins: 2; Case Code (Metric): 2012; Case Code (Imperial): 0805; Min Operating Temperature: -30°C; Max Operating Temperature: 85°C; Package Quantity: 1; Voltage Rating: 50V; Packaging: Tape and Reel; Voltage Rating (DC): 50V; Dielectric: Y5V; Termination: SMD/SMT; Voltage: 50V; Length: 2mm; Height: 0.9mm; Lead Pitch: 0.75mm; Width: 0.049inch; Thickness: 0.039inch; Depth: 1.25mm; Radiation Hardening: No; REACH SVHC: No SVHC; Lead Free: Lead Free; ComponentLink1URL: http://www.alliedelec.com/m/d/9bfe7773041ffe9d406e68bc7b377fdd.pdf?src-supplier=Allied+Electronics; ComponentLink1Description: http://www.alliedelec.com/m/d/9bfe7773041ffe9d406e68bc7b377fdd.pdf?src-supplier=Allied+Electronics; ComponentLink2URL: https://www.verical.com/server-webapp/html/getDatasheet?partID=37101&src-supplier=Verical; ComponentLink2Description: https://www.verical.com/server-webapp/html/getDatasheet?partID=37101&src-supplier=Verical; ComponentLink3URL: https://www.verical.com/server-webapp/html/getDatasheet?partID=321176&src-supplier=Verical; ComponentLink3Description: https://www.verical.com/server-webapp/html/getDatasheet?partID=321176&src-supplier=Verical; ComponentLink4URL: http://www.farnell.com/datasheets/2123124.pdf?src-supplier=Element14; ComponentLink4Description: http://www.farnell.com/datasheets/2123124.pdf?src-supplier=Element14; Supplier Part Number 1: 399-1177-6-ND
JP1 = 2PIN-TEST: CONN HEADER VERT 2POS 2.54MM
R23 = 0603-120R: RES SMD 120 OHM 1% 1/10W 0603; Manufacturer: Yageo; Manufacturer Part Number: RC0603FR-07120RL; Voltage Rating (DC): 50V; Temperature Coefficient: 100ppm/°C; Power Rating: 100mW; Supplier 1: Digi-Key; Stock 1: 1047274; Pricing 1: 1=0.1, 10=0.023, 100=0.0094, 1000=0.00421, 2500=0.00366 (USD); Case/Package: 0603; Number of Pins: 2; Case Code (Metric): 1608; Case Code (Imperial): 0603; Min Operating Temperature: -55°C; Max Operating Temperature: 155°C; Resistance: 120R; Tolerance: 1%; Packaging: Tape and Reel; Composition: Thick Film; Voltage Rating: 50V; Package Quantity: 1; Number of Terminations: 2; Termination: SMD/SMT; Military Standard: Not; Max Power Dissipation: 100mW; Features: Moisture Resistant; Length: 1.6mm; Height: 0.022inch; Width: 0.031inch; Depth: 0.8mm; REACH SVHC: No SVHC; Lead Free: Lead Free; ComponentLink1URL: http://www.yageo.com/documents/recent/PYu-RC_Group_51_RoHS_L_10.pdf?src-supplier=Digi-Key; ComponentLink1Description: http://www.yageo.com/documents/recent/PYu-RC_Group_51_RoHS_L_10.pdf?src-supplier=Digi-Key; ComponentLink2URL: http://www.farnell.com/datasheets/2167052.pdf?src-supplier=Element14; ComponentLink2Description: http://www.farnell.com/datasheets/2167052.pdf?src-supplier=Element14; ComponentLink3URL: http://www.farnell.com/datasheets/1868787.pdf?src-supplier=Element14; ComponentLink3Description: http://www.farnell.com/datasheets/1868787.pdf?src-supplier=Element14; ComponentLink4URL: http://www.farnell.com/datasheets/443971.pdf?src-supplier=Element14; ComponentLink4Description: http://www.farnell.com/datasheets/443971.pdf?src-supplier=Element14; Supplier Part Number 1: 311-120HRDKR-ND
R24 = RC0603JR-0710KL: RES SMD 10K OHM 5% 1/10W 0603; Manufacturer: Yageo; Resistance: 10kR; Voltage Rating (DC): 50V; Temperature Coefficient: 100ppm/°C; Power Rating: 100mW; Supplier 1: Digi-Key; Manufacturer Part Number: RC0603JR-0710KL; Stock 1: 3006558; Pricing 1: 1=0.1, 10=0.019, 100=0.0077, 1000=0.00347, 2500=0.00301 (USD); Case/Package: 0603; Number of Pins: 2; Contact Plating: Tin,Matte; Case Code (Imperial): 0603; Case Code (Metric): 1608; Min Operating Temperature: -55°C; Max Operating Temperature: 155°C; Packaging: Tape and Reel; Tolerance: 5%; Composition: Thick Film; Voltage Rating: 50V; Termination: SMD/SMT; Military Standard: Not; Features: Moisture Resistant; Max Power Dissipation: 100mW; Number of Terminations: 2; Length: 0.063inch; Width: 0.031inch; Depth: 0.8mm; Height - Seated (Max): 0.022inch; Radiation Hardening: No; REACH SVHC: Unknown; Lead Free: Lead Free; ComponentLink1URL: http://www.yageo.com/documents/recent/PYu-RC_Group_51_RoHS_L_10.pdf?src-supplier=Digi-Key; ComponentLink1Description: http://www.yageo.com/documents/recent/PYu-RC_Group_51_RoHS_L_10.pdf?src-supplier=Digi-Key; Supplier Part Number 1: 311-10KGRDKR-ND
U3 = MCP2515-E/ML: CAN CONTROLLER, 1TX/RX, QFN-20; IC Interface Type:SPI; No. of TX Buffers:3; No. of RX Buffers:2; Supply Voltage Min:2.7V; Supply Voltage Max:5.5V; Interface Case Style:QFN; No. of Pins:20; Operating Temperature Min:-40°C; Operating ;RoHS Compliant: Yes; Manufacturer: Microchip; Interface: SPI; Operating Supply Current: 10mA; Number of Transceivers: 1; Max Supply Voltage: 5.5V; Min Supply Voltage: 2.7V; Number of Transmit Buffers: 3; Number of Receive Buffers: 2; Supplier 1: Digi-Key; Manufacturer Part Number: MCP2515-E/ML; RoHS: Yes; Category: Integrated Circuits (ICs); Stock 1: 1168; Pricing 1: 1=2.58000, 25=2.34000 (USD); Mount: Surface Mount; Case/Package: QFN; Number of Pins: 20; Min Operating Temperature: -40°C; Max Operating Temperature: 125°C; Packaging: Rail/Tube; Package Quantity: 91; Max Supply Current: 10mA; Length: 4mm; Width: 4mm; Height: 0.95mm; REACH SVHC: No SVHC; ComponentLink1URL: https://datasheet.ciiva.com/46406/1669372-46406021.pdf?src-supplier=Element14; ComponentLink1Description: https://datasheet.ciiva.com/46406/1669372-46406021.pdf?src-supplier=Element14; Supplier Part Number 1: MCP2515-E/ML-ND
U4 = CAN TRAN-MCP2562T-E/SN: IC TRANSCEIVER HALF 1/1 8SOIC; Manufacturer: Microchip; Propagation Delay: 125ns; Data Rate: 1Mbps; Nominal Supply Current: 85uA; Max Supply Voltage: 5.5V; Min Supply Voltage: 4.5V; Number of Transceivers: 1; Receiver Hysteresis: 200mV; Supplier 1: Digi-Key; Manufacturer Part Number: MCP2562T-E/SN; Stock 1: 0; Pricing 1: 1=0.9, 25=0.75, 100=0.68 (USD); Mount: Surface Mount; Case/Package: SOIC; Number of Pins: 8; Min Operating Temperature: -40°C; Max Operating Temperature: 125°C; Packaging: Tape and Reel; Package Quantity: 3300; Turn-On Delay Time: 125ns; Radiation Hardening: No; Lead Free: Lead Free; ComponentLink1URL: http://ww1.microchip.com/downloads/en/DeviceDoc/25167B.pdf?src-supplier=Digi-Key; ComponentLink1Description: http://ww1.microchip.com/downloads/en/DeviceDoc/25167B.pdf?src-supplier=Digi-Key; ComponentLink2URL: http://ww1.microchip.com/downloads/en/DeviceDoc/25167B.pdf?src-supplier=Avnet; ComponentLink2Description: http://ww1.microchip.com/downloads/en/DeviceDoc/25167B.pdf?src-supplier=Avnet; Supplier Part Number 1: MCP2562T-E/SNDKR-ND
U5 = MCP48FVB01T-E/UN: IC DAC 8BIT V-OUT 10MSOP; Manufacturer: Microchip; Number of Bits: 8; Number of D/A Converters: 1; Settling Time: 7.8us; Differential Output: No; Interface: SPI; Supplier 1: Digi-Key; Manufacturer Part Number: MCP48FVB01T-E/UN; Stock 1: 0; Pricing 1: 2500=0.585 (USD); Case/Package: MSOP; Min Operating Temperature: -40°C; Max Operating Temperature: 125°C; Packaging: Tape and Reel; RoHS Compliant: Yes; ComponentLink1URL: http://www.microchip.com/mymicrochip/filehandler.aspx?ddocname=en584450&src-supplier=Digi-Key; ComponentLink1Description: http://www.microchip.com/mymicrochip/filehandler.aspx?ddocname=en584450&src-supplier=Digi-Key; Supplier Part Number 1: MCP48FVB01T-E/UN-ND
Y1 = Crysatl-16Mhz: CRYSTAL 16.0000MHZ 18PF SMD; Manufacturer: Abracon; Manufacturer Part Number: ABLS2-16.000MHZ-D4Y-T; Frequency: 16MHz; Frequency Tolerance: 30ppm; ESR (Equivalent Series Resistance): 40R; Supplier 1: Digi-Key; Stock 1: 11099; Pricing 1: 1=0.46, 10=0.385, 50=0.3466, 100=0.308, 500=0.2926 (USD); Mount: Surface Mount; Min Operating Temperature: -40°C; Max Operating Temperature: 85°C; Package Quantity: 1000; Load Capacitance: 18pF; Packaging: Tape and Reel; Tolerance: 30ppm; Frequency Stability: 30ppm; Termination: SMD/SMT; Series Resistance: 40R; Length: 11.05mm; Height: 0.13inch; Width: 0.185inch; Depth: 4.8mm; REACH SVHC: Unknown; Lead Free: Lead Free; ComponentLink1URL: https://abracon.com/Resonators/ABLS2.pdf?src-supplier=Digi-Key; ComponentLink1Description: https://abracon.com/Resonators/ABLS2.pdf?src-supplier=Digi-Key; ComponentLink2URL: http://www.abracon.com/Resonators/ABLS2.pdf?src-supplier=Digi-Key; ComponentLink2Description: http://www.abracon.com/Resonators/ABLS2.pdf?src-supplier=Digi-Key; ComponentLink3URL: https://www.verical.com/server-webapp/html/getDatasheet?partID=719900&src-supplier=Verical; ComponentLink3Description: https://www.verical.com/server-webapp/html/getDatasheet?partID=719900&src-supplier=Verical; Supplier Part Number 1: 535-9875-6-ND

## Nets that join several sheets
3V3: Connector (U1.1 U1.17), SPI (U4.5 U5.1 U5.3)
5V: Connector (J1.2 U1.2 U1.4), SpeedLEDs (U2.3 U2.4 U2.16), SPI (U3.17 U3.18 U4.3)
12V: Connector (J1.1), VoltageLEDs (42 pins)
GND: Connector (12 pins), SpeedLEDs (8 pins), VoltageLEDs (15 pins), SPI (10 pins)
A: Connector (U1.36), SpeedLEDs (U2.7)
B: Connector (U1.40), SpeedLEDs (U2.1)
C: Connector (U1.38), SpeedLEDs (U2.2)
CAN_N: Connector (J1.10), SPI (R23.1 U4.6)
CAN_P: Connector (J1.9), SPI (JP1.1 U4.7)
CONTROL: VoltageLEDs (U6.5 U7.5 U8.5), SPI (C3.2 R24.2 U5.4)
CS_1: Connector (U1.24), SPI (U3.16)
CS_2: Connector (U1.26), SPI (U5.2)
D: Connector (U1.37), SpeedLEDs (U2.6)
LED-1: Connector (U1.29), SpeedLEDs (Q6.1 R20.2)
LED-2: Connector (U1.31), SpeedLEDs (Q7.1 R21.2)
LED-3: Connector (U1.35), SpeedLEDs (Q8.1 R22.2)
SCK: Connector (U1.23), SPI (U3.12 U5.9)
SDI: Connector (U1.19), SPI (U3.14 U5.10)
SDO: Connector (U1.21), SPI (U3.15 U5.8)